# EAGLE design boosst_revA (EAGLE 6.2)
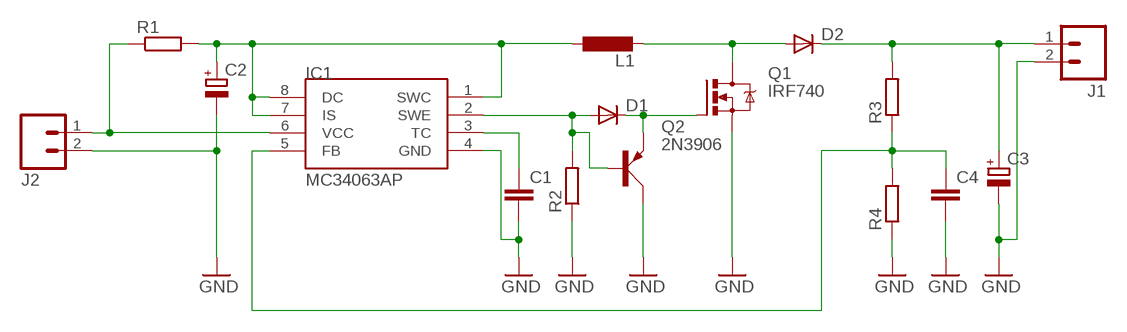
[diagram p0: schematic, sheet 1]

## Parts
C1  C-EU025-025X050  [C025-025X050]
C2  CPOL-EUE5-8.5  [E5-8,5]
C3  CPOL-EUE5-8.5  [E5-8,5]
C4  C-EU025-025X050  [C025-025X050]
D1  DIODE-D-5  [D-5]
D2  DIODE-DO41-7.6  [DO41-7.6]
IC1  MC34063AP  [DIL08]
J1  M023.5MM  [SCREWTERMINAL-3.5MM-2]
J2  M023.5MM  [SCREWTERMINAL-3.5MM-2]
L1  L-EU6000-XXX-RC  [6000-XXXX-RC]
Q1  IRF740  [TO220BV]
Q2  2N3906  [TO92D]
R1  R-EU_0309/10  [0309/10]
R2  R-EU_0204/5  [0204/5]
R3  R-EU_0204/7  [0204/7]
R4  R-EU_0204/7  [0204/7]

## Nets
GND: C1.2 C2.- C3.- C4.2 IC1.4(GND) J1.2 J2.2 Q1.S Q2.C R2.1 R4.1
N$1: C3.+ D2.C J1.1 R3.2
N$2: D1.C Q1.G Q2.E
N$3: D1.A IC1.2(SWE) Q2.B R2.2
N$4: C1.1 IC1.3(TC)
N$5: C4.1 IC1.5(FB) R3.1 R4.2
N$6: C2.+ IC1.1(SWC) IC1.7(IS) IC1.8(DC) L1.1 R1.2
N$8: D2.A L1.2 Q1.D
VIN: IC1.6(VCC) J2.1 R1.1

## Library data of the parts
C1 C4 = rcl:C-EU: CAPACITOR, European symbol
C2 C3 = rcl:CPOL-EU: POLARIZED CAPACITOR, European symbol
D1 D2 = diode:DIODE-: DIODE
IC1 = mc34063:MC34063
J1 J2 = SparkFun-Connectors:M02: Standard 2-pin 0.1" header. Use with - straight break away headers ( PRT-00116) - right angle break away headers (PRT-00553) - swiss pins (PRT-00743) - machine pins (PRT-00117) - female headers (PRT-00115) Molex polarized connector foot print use with: PRT-08233 with associated crimp pins and housings. 2.54_SCREWTERM for use with PRT-10571. 3.5mm Screw Terminal footprints for PRT-08084 5mm Screw Terminal footprints for use with PRT-08432; PROD_ID: CONN-08399
L1 = rcl:L-EU: INDUCTOR, European symbol
Q1 = transistor-power:IRF740: N-CHANNEL MOS FET
Q2 = transistor-small-signal:2N3906: PNP TRANSISTOR
R1-R4 = rcl:R-EU_: RESISTOR, European symbol

## Board
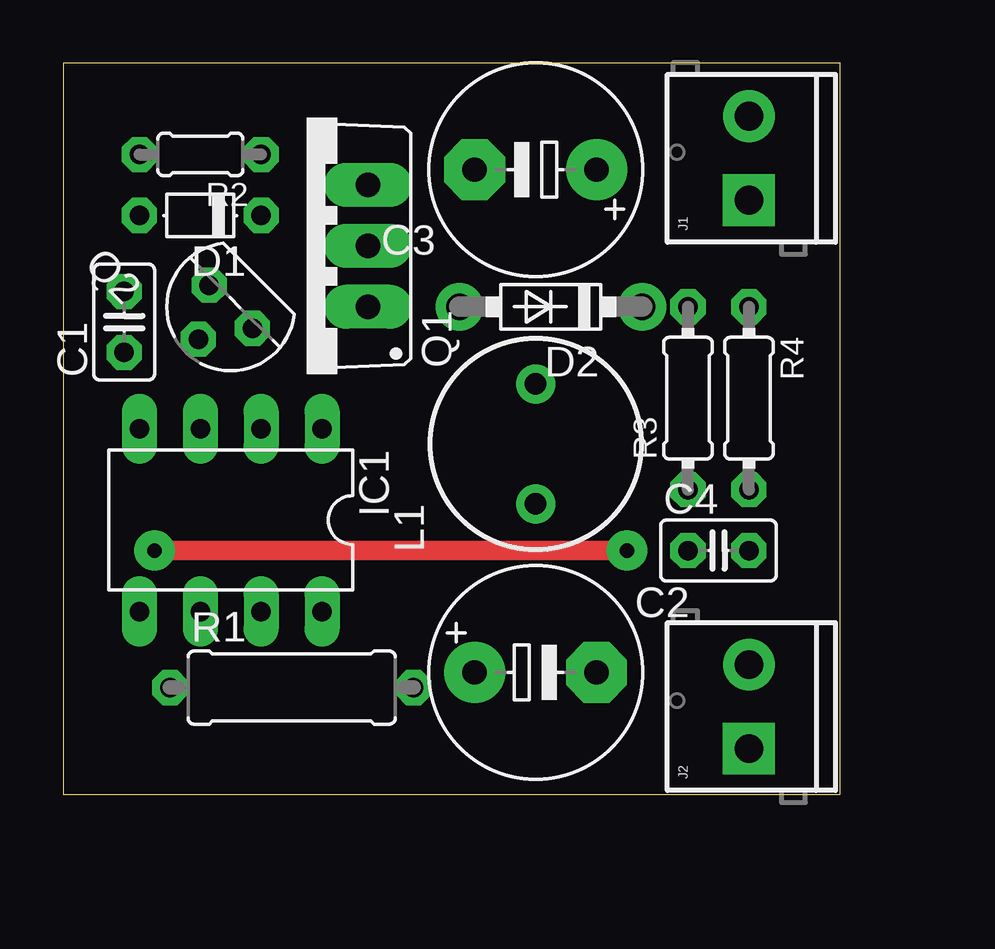
[diagram p1: board, top side]
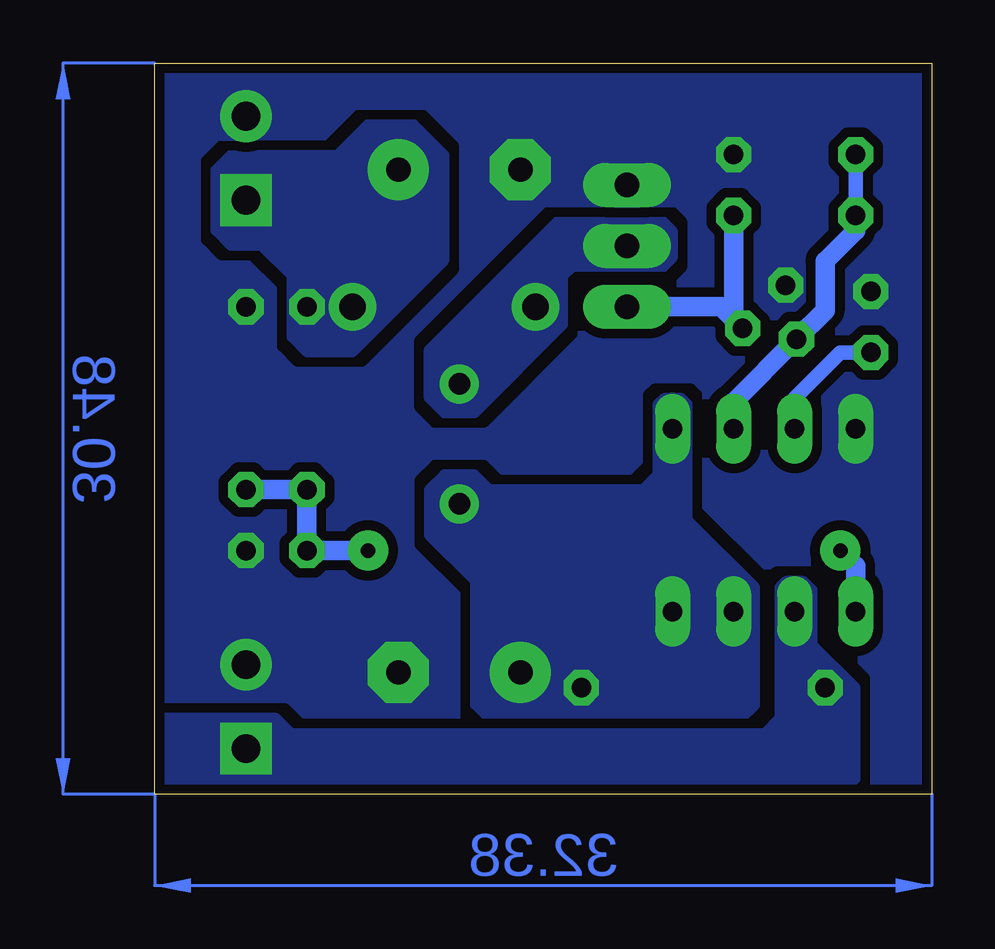
[diagram p2: board, bottom side, seen from below]

Size 32.38 x 30.48 mm. Coordinates in mm from the lower left corner, seen from the top.
Outline: 0,0 32.38,0 32.38,30.48 0,30.48 0,0
Copper layers (1*16): Top 0.0356mm / dielectric 1.5011mm / Bottom 0.0356mm
Design rules "default": minimum track width 6mil, minimum drill 13mil, track to track 6mil, track to pad 6mil, pad to pad 6mil, via to via 6mil, smd to smd 6mil, copper to edge 10mil, drill to drill 6mil, minimum pad ring 7mil, minimum via ring 7mil, stop-mask expansion 2.5mil, vias tented up to drill 0mil, thermal gap 10mil

### Footprints (pad centres in the part's own frame; a part is rotated, then mirrored left to right if it is on the bottom)
C025-025X050 = drill 0.813 octagon: 1 -1.27,0; 2 1.27,0
E5-8,5 = drill 1.016 pad 2.54: + -2.54,0 | drill 1.016 pad 2.54 octagon: - 2.54,0
D-5 = drill 0.813 octagon: A 2.54,0; C -2.54,0
DO41-7.6 = drill 1.1 pad 1.7: A 3.81,0; C -3.81,0
DIL08 = drill 0.813 long: 1 -3.81,-3.81; 2 -1.27,-3.81; 3 1.27,-3.81; 4 3.81,-3.81; 5 3.81,3.81; 6 1.27,3.81; 7 -1.27,3.81; 8 -3.81,3.81
SCREWTERMINAL-3.5MM-2 = drill 1.2 pad 2.032 square: 1 0,0 | drill 1.2 pad 2.032: 2 3.5,0
6000-XXXX-RC = drill 0.9 pad 1.422: 1 -2.5,0; 2 2.5,0
TO220BV = drill 1.016 long: D 0,-2.54; G -2.54,-2.54; S 2.54,-2.54
TO92D = drill 0.813 octagon: B 0,1.905; C 1.27,0; E -1.27,0
0309/10 = drill 0.813 octagon: 1 -5.08,0; 2 5.08,0
0204/5 = drill 0.813 octagon: 1 -2.54,0; 2 2.54,0
0204/7 = drill 0.813 octagon: 1 -3.81,0; 2 3.81,0

### Placement (x,y rotation side)
C1  2.54,19.68 90 top
C2  19.68,5.08 0 top
C3  19.68,26.04 180 top
C4  27.3,10.16 0 top
D1  5.71,24.13 180 top
D2  20.32,20.32 180 top
IC1  6.99,11.43 180 top
J1  28.57,24.77 90 top
J2  28.57,1.91 90 top
L1  19.68,14.61 90 top
Q1  10.16,22.86 90 top
Q2  6.99,20.32 135 top
R1  9.53,4.45 0 top
R2  5.71,26.67 180 top
R3  26.04,16.51 90 top
R4  28.57,16.51 270 top

### Tracks (layer width: path | path; a pad name or v marks a point on that pad's centre or on a via)
GND
  pour Bottom (isolate 0.406, rank 6, no thermals): 0,30.48 32.38,30.48 32.38,0 0,0
N$1
  pour Bottom (isolate 0.406, no thermals): 24.13,18.41 26.04,18.41 26.67,19.05 26.67,21.59 27.94,22.86 29.21,22.86 29.84,23.5 29.84,26.04 29.21,26.67 24.77,26.67 23.5,27.94 21.59,27.94 20.32,26.67 20.32,22.23
N$2
  Bottom 0.813: D1.C 8.26,19.79 Q2.E 8.78,20.32 Q1.G
N$3
  Bottom 0.61: R2.2 D1.A
  Bottom 0.813: D1.A 3.17,23.5 4.45,22.23 4.45,20.17 Q2.B 8.26,16.36 IC1.2
N$4
  Bottom 0.61: IC1.3 5.71,16.51 3.81,18.41 C1.1
N$5  (via drill 0.6 pad 1.68)
  Top 0.813: v23.5,10.16 v3.81,10.16
  Bottom 0.813: v23.5,10.16 C4.1 R3.1 R4.2 | IC1.5 3.17,9.53 v3.81,10.16
N$6
  pour Bottom (isolate 0.406, rank 2, no thermals): 18.41,12.7 19.05,13.34 20.32,13.34 20.95,12.7 20.95,10.79 19.05,8.89 19.05,3.74 18.48,3.17 7.9,3.17 7.37,3.71 7.37,8.64 10.16,11.43 10.16,16.26 10.41,16.51 11.18,16.51 11.43,16.26 11.43,13.34 12.06,12.7
N$8
  pour Bottom (isolate 0.406, no thermals): 12.57,21.97 14.99,21.97 15.37,21.59 15.37,19.56 19.05,15.88 20.32,15.88 20.95,16.51 20.95,18.54 15.62,23.88 11.18,23.88 10.79,23.5 10.79,22.35 11.18,21.97
VIN
  pour Bottom (isolate 0.406, no thermals): 6.99,2.54 26.67,2.54 27.3,3.17 32.38,3.17 32.38,0 3.81,0 3.17,0.64 3.17,4.45 4.95,6.22 4.95,8.51 5.33,8.89 6.1,8.89 6.35,8.64 6.35,3.17
(copper drawn outside any net)
  shapes: Bottom area x2